# Altium schematic sheet mcu.SchDoc
size A3; SheetNumber: 5; SheetTotal: 11
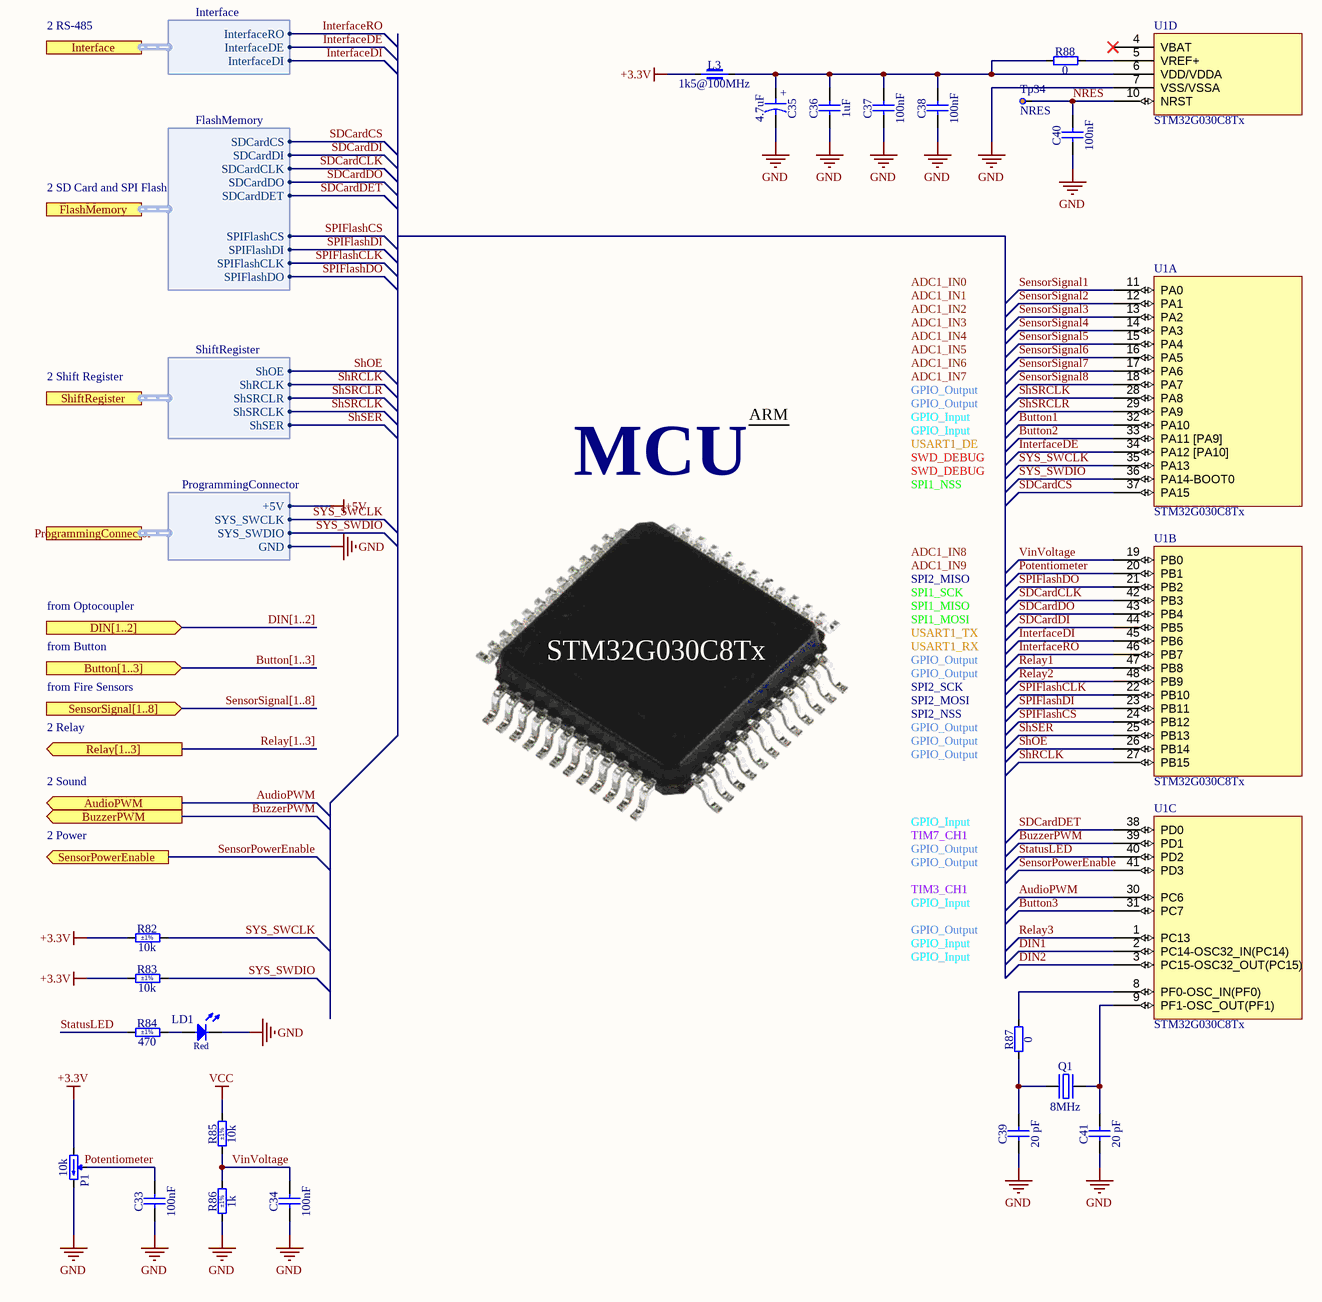
[diagram p0: mcu.SchDoc]

## Parts
C33  100nF  [CAPC1608X87N]
C34  100nF  [CAPC1608X87N]
C35  4.7uF  [CAPMP3216X180N]
C36  1uF  [CAPC1608X87N]
C37  100nF  [CAPC1608X87N]
C38  100nF  [CAPC1608X87N]
C39  20 pF  [CAPC1608X90N]
C40  100nF  [CAPC1608X87N]
C41  20 pF  [CAPC1608X90N]
L3  1k5@100MHz  [INDC2012X110N]
LD1  Red  [LED_AVAGO_HSMH-C150]
P1  10k  [TRIM_BOURNS_3296W]
Q1  8MHz  [XTAL_TXC_7A]
R82  10k  Tolerance: ±1%  [RESC1608X55N]
R83  10k  Tolerance: ±1%  [RESC1608X55N]
R84  470  Tolerance: ±1%  [RESC1608X55N]
R85  10k  Tolerance: ±1%  [RESC1608X55N]
R86  1k  Tolerance: ±1%  [RESC1608X55N]
R87  0  [RESC1608X55N]
R88  0  [RESC1608X55N]
Tp34  NRES  [TP_C40]
U1  STM32G030C8Tx  [ST LQFP-48 7x7MM]  (parts A,B,C,D of 4)

## Ports
AudioPWM (out), Button[1..3] (in), BuzzerPWM (out), DIN[1..2] (in), FlashMemory (harness FlashMemory), Interface (harness Interface), ProgrammingConnector (harness ProgrammingConnector), Relay[1..3] (out), SensorPowerEnable (out), SensorSignal[1..8] (in), ShiftRegister (harness ShiftRegister)

## Harnesses
Interface: InterfaceRO, InterfaceDE, InterfaceDI
FlashMemory: SDCardDO, SDCardCLK, SDCardDI, SDCardCS, SPIFlashCS, SDCardDET, SPIFlashDO, SPIFlashDI, SPIFlashCLK
ShiftRegister: ShOE, ShRCLK, ShSRCLR, ShSRCLK, ShSER
ProgrammingConnector: +5V, SYS_SWCLK, SYS_SWDIO, GND

## Nets
+3.3V: L3.1 P1.1(CCW) R82.1 R83.1
+5V: port ProgrammingConnector.+5V
GND: C33.1 C34.1 C35.2 C36.1 C37.1 C38.1 C39.1 C40.1 C41.1 LD1.1(C) P1.3(CW) R86.1 U1.7(VSS/VSSA) ; port ProgrammingConnector.GND
VCC: R85.2
AudioPWM: U1.30(PC6) ; port AudioPWM
Button1: U1.32(PA10)
Button2: U1.33(PA11_[PA9])
Button3: U1.31(PC7)
BuzzerPWM: U1.39(PD1) ; port BuzzerPWM
DIN1: U1.2(PC14-OSC32_IN(PC14))
DIN2: U1.3(PC15-OSC32_OUT(PC15))
InterfaceDE: U1.34(PA12_[PA10]) ; port Interface.InterfaceDE
InterfaceDI: U1.45(PB6) ; port Interface.InterfaceDI
InterfaceRO: U1.46(PB7) ; port Interface.InterfaceRO
NRES: C40.2 Tp34.1 U1.10(NRST)
Potentiometer: C33.2 P1.2(W) U1.20(PB1)
Relay1: U1.47(PB8)
Relay2: U1.48(PB9)
Relay3: U1.1(PC13)
SDCardCLK: U1.42(PB3) ; port FlashMemory.SDCardCLK
SDCardCS: U1.37(PA15) ; port FlashMemory.SDCardCS
SDCardDET: U1.38(PD0) ; port FlashMemory.SDCardDET
SDCardDI: U1.44(PB5) ; port FlashMemory.SDCardDI
SDCardDO: U1.43(PB4) ; port FlashMemory.SDCardDO
SensorPowerEnable: U1.41(PD3) ; port SensorPowerEnable
SensorSignal1: U1.11(PA0)
SensorSignal2: U1.12(PA1)
SensorSignal3: U1.13(PA2)
SensorSignal4: U1.14(PA3)
SensorSignal5: U1.15(PA4)
SensorSignal6: U1.16(PA5)
SensorSignal7: U1.17(PA6)
SensorSignal8: U1.18(PA7)
ShOE: U1.26(PB14) ; port ShiftRegister.ShOE
ShRCLK: U1.27(PB15) ; port ShiftRegister.ShRCLK
ShSER: U1.25(PB13) ; port ShiftRegister.ShSER
ShSRCLK: U1.28(PA8) ; port ShiftRegister.ShSRCLK
ShSRCLR: U1.29(PA9) ; port ShiftRegister.ShSRCLR
SPIFlashCLK: U1.22(PB10) ; port FlashMemory.SPIFlashCLK
SPIFlashCS: U1.24(PB12) ; port FlashMemory.SPIFlashCS
SPIFlashDI: U1.23(PB11) ; port FlashMemory.SPIFlashDI
SPIFlashDO: U1.21(PB2) ; port FlashMemory.SPIFlashDO
StatusLED: R84.1 U1.40(PD2)
SYS_SWCLK: R82.2 U1.35(PA13) ; port ProgrammingConnector.SYS_SWCLK
SYS_SWDIO: R83.2 U1.36(PA14-BOOT0) ; port ProgrammingConnector.SYS_SWDIO
VinVoltage: C34.2 R85.1 R86.2 U1.19(PB0)
NetC35_1: C35.1 C36.2 C37.2 C38.2 L3.2 R88.1 U1.6(VDD/VDDA)
NetC39_2: C39.2 Q1.1(OSC1) R87.1
NetC41_2: C41.2 Q1.2(OSC2) U1.9(PF1-OSC_OUT(PF1))
NetLD1_2: LD1.2(A) R84.2
NetR87_2: R87.2 U1.8(PF0-OSC_IN(PF0))
NetR88_2: R88.2 U1.5(VREF+)

Not connected (* = marked no-connect by the designer): U1 4(VBAT)*

## Buses and harness runs
bus Button[1..3] = port Button[1..3]
bus DIN[1..2] = port DIN[1..2]
bus Relay[1..3] = port Relay[1..3]
bus SensorSignal[1..8] = port SensorSignal[1..8]

## Notes on the sheet
- 2 RS-485
- 2 SD Card and SPI Flash
- ADC1_IN0
- ADC1_IN1
- ADC1_IN2
- ADC1_IN3
- ADC1_IN4
- 2 Shift Register
- ADC1_IN5
- ADC1_IN6
- ADC1_IN7
- GPIO_Output
- ARM
- USART1_DE
- SWD_DEBUG
- GPIO_Input
- MCU
- SPI1_NSS
- from Optocoupler
- ADC1_IN8
- ADC1_IN9
- SPI2_MISO
- SPI1_MISO
- SPI1_SCK
- from Button
- STM32G030C8Tx
- USART1_RX
- USART1_TX
- SPI1_MOSI
- from Fire Sensors
- 2 Relay
- SPI2_SCK
- SPI2_MOSI
- SPI2_NSS
- 2 Sound
- 2 Power
- TIM7_CH1
- TIM3_CH1
- THIS DOCUMENT AND THE DATA DISCLOSED HEREIN OR
- HEREWITH IS THE PROPERTY OF ALTIUM LIMITED AND MAY
- DWG NO:
- REVISION
- REV:
- DESCRIPTION
- DATE
- APPROVED
- BE FREELY DISTRIBUTED IN WHOLE. NO RIGHTS ARE
- RESERVED OR EXPRESS OR IMPLIED WARANTEE GIVEN.
- ENG:
- APPROVALS
- PROJECT
- DSN:
- CHK:
- REFERENCE DOCUMENTS
- PROJECT REVISION:
- TITLE
- DOCUMENT REVISION:
- DESIGN ITEM:
- BOM:
- FAB DWG:
- PCB DWG:
- ASSY DWG:
- SCALE:
- A3
- SIZE
- CAGE CODE
- FILE NAME
- DWG NO.
- SHEET
- OF
- REV
- (in symbol CTE3216-18_4.7UF_10V_10%_AVX_TPSA475K010T1400) +

## Library data of the parts
C33 C34 C37 C38 C40 = CC0603_100NF_50V_10%_X7R: Non-polarised capacitor; Part Description: SMD Multilayer Chip Ceramic Capacitor; Manufacturer: GENERIC; Manufacturer1 Part Number: 223858615649; Voltage: 50V; TC: X7R; Tolerance: ±10%; Part Number: CC0603_100NF_50V_10%_X7R; Component Kind: Standard; Component Type: Standard; Pin Count: 2; Value: 100nF; Status: Preferred; Manufacturer Part Number: CC0603_100NF_50V_10%_X7R; Case: 0603; Mounted: Yes; Socket: No; SMD: Yes; Sense: No; Manufacturer1 Example: PHYCOMP; Manufacturer1 ComponentHeight: 0.87mm; HelpURL: \\cern.ch\dfs\Applications\Altium\Datasheets\CC0603_X7R_PHYCOMP.pdf; Author: CERN DEM JLC; CreateDate: 03.12.2007; LatestRevisionDate: 03.12.2007
C35 = CTE3216-18_4.7UF_10V_10%_AVX_TPSA475K010T1400: Polarised capacitor; Part Description: Low ESR 1R4 Automotive Solid Tantalum Chip Capacitor; Manufacturer: AVX; Voltage: 10V; Tolerance: ±10%; Part Number: CTE3216-18_4.7UF_10V_10%_AVX_TPSA475K010T1400; Component Kind: Standard; Component Type: Standard; Pin Count: 2; Value: 4.7uF; Status: Preferred; Manufacturer Part Number: TPSA475K010T1400; Case: A; Mounted: Yes; Socket: No; SMD: Yes; Sense: No; ComponentHeight: 1.8mm; HelpURL: \\cern.ch\dfs\Applications\Altium\Datasheets\CTE-LESR_AVX_TPS-AUTO.pdf; Author: CERN DEM JLC; CreateDate: 23.01.2018; LatestRevisionDate: 23.01.2018
C36 = CC0603_1UF_16V_10%_X7R: Non-polarised capacitor; Part Description: SMD Multilayer Chip Ceramic Capacitor; Manufacturer: GENERIC; Manufacturer1 Part Number: 223878615663; Voltage: 16V; TC: X7R; Tolerance: ±10%; Part Number: CC0603_1UF_16V_10%_X7R; Component Kind: Standard; Component Type: Standard; Pin Count: 2; Value: 1uF; Status: None; Manufacturer Part Number: CC0603_1UF_16V_10%_X7R; Case: 0603; Mounted: Yes; Socket: No; SMD: Yes; Sense: No; Manufacturer1 Example: YAGEO PHYCOMP; Manufacturer1 ComponentHeight: 0.9mm; HelpURL: \\cern.ch\dfs\Applications\Altium\Datasheets\CC0603_X7R_PHYCOMP.pdf; Author: CERN DEM JLC; CreateDate: 03.12.2007; LatestRevisionDate: 17.04.2015
C39 C41 = CC0603_20PF_50V_5%_NP0: Non-polarised capacitor; Part Description: SMD Multilayer Chip Ceramic Capacitor; Manufacturer: GENERIC; Manufacturer1 Part Number: CC0603JRNPO9BN200; Voltage: 50V; TC: C0G/NP0; Tolerance: ±5 %; Part Number: CC0603_20PF_50V_5%_NP0; Component Kind: Standard; Component Type: Standard; Pin Count: 2; Value: 20 pF; Status: Preferred; Manufacturer Part Number: CC0603_20PF_50V_5%_NP0; Case: 0603; Mounted: Yes; Socket: No; SMD: Yes; Sense: No; Manufacturer1 Example: YAGEO PHYCOMP; Manufacturer1 ComponentHeight: 0.9 mm; HelpURL: \\cern.ch\dfs\Applications\Altium\Datasheets\CC0603_NPO_YAGEO.pdf; Author: CERN DEM JMW; CreateDate: 27.07.2021; LatestRevisionDate: 27.07.2021
L3 = IND0805_WURTH_742792097: Part Description: SMD EMI Suppression Chip Ferrite Bead (WE-CBF Series); Manufacturer: WURTH ELEKTRONIK; Power: 1A; Resistance: 0.3R; Tolerance: ±25%; Part Number: IND0805_WURTH_742792097; Component Kind: Standard; Component Type: Standard; Pin Count: 2; Value: 1k5@100MHz; Manufacturer Part Number: 742792097; Case: 0805; Mounted: Yes; Socket: No; SMD: Yes; Sense: No; ComponentHeight: 1.1mm; HelpURL: \\cern.ch\dfs\Applications\Altium\Datasheets\IND0805_WURTH_742792097.pdf; Author: CERN DEM MR; CreateDate: 29.06.2017; LatestRevisionDate: 25.10.2018
LD1 = LED_AVAGO_HSMH-C150: LED Red 1C 2A; Part Description: Red Diffused Surface Mount LED (1206 Case); Manufacturer: AVAGO TECHNOLOGIES; PressFit: No; Bonding: No; Part Number: LED_AVAGO_HSMH-C150; Component Kind: Standard; Component Type: Standard; Color: Red; PackageDescription: Red Diffused Chip LED, 2-Leads, Body 3.2 x1.6mm, IPC Medium Density; Manufacturer Part Number: HSMH-C150; Pin Count: 2; Case: 1206; Mounted: Yes; Socket: No; SMD: Yes; Sense: No; ComponentHeight: 1.2mm; HelpURL: \\cern.ch\dfs\Applications\Altium\Datasheets\LED_AVAGO_HSMH-C150.pdf; Author: CERN DEM JLC; CreateDate: 08.03.2018; LatestRevisionDate: 08.03.2018
P1 = TRIM_25T_10K_BOURNS_3296W-1-103LF: Trimming Potentiometer; Part Description: 25 Turn Trimming Potentiometer (Top Adjustment); Manufacturer: BOURNS; Power: 0.5W; TC: ±100ppm/°C; Tolerance: ±10%; PressFit: No; Part Number: TRIM_25T_10K_BOURNS_3296W-1-103LF; Component Kind: Standard; Component Type: Standard; Pin Count: 3; Value: 10k; Manufacturer Part Number: 3296W-1-103LF; Case: 3296W; Mounted: Yes; Socket: No; SMD: No; Sense: No; ComponentHeight: 11.55mm; HelpURL: \\cern.ch\dfs\Applications\Altium\Datasheets\TRIM_BOURNS_3296W.pdf; Author: CERN DEM BC; CreateDate: 02.11.2021; LatestRevisionDate: 02.11.2021
Q1 = XTAL_8MHZ_TXC_7A-8.000MAAE-T: Quartz Crystal; Part Description: Tolerance: ± 30ppm, Stability: ±30ppm, -20°C to +70°C, 12pF, SMD Glass Seam Sealing Crystal, 7A Series; Manufacturer: TXC CORPORATION; PressFit: No; Bonding: No; Part Number: XTAL_8MHZ_TXC_7A-8.000MAAE-T; Component Kind: Standard; Component Type: Standard; PackageDescription: SMD Glass Seam Sealing Crystal, 2 Pins, 3.20mm L X 5.00mm W, 7A Serie; Value: 8MHz; Manufacturer Part Number: 7A-8.000MAAE-T; Pin Count: 2; Mounted: Yes; Socket: No; SMD: Yes; Sense: No; ComponentHeight: 1.2mm; HelpURL: \\cern.ch\dfs\Applications\Altium\Datasheets\XTAL_TXC_7A.pdf; Author: CERN DEM JLC; CreateDate: 09.10.2014; LatestRevisionDate: 12.11.2014
R82 R83 R85 = R0603_10K_1%_0.1W_100PPM: Resistor - 1%; Part Description: General Purpose Thick Film Chip Resistor; Manufacturer: GENERIC; Manufacturer1 Part Number: NRC06F1002TRF; Power: 0.1W; TC: ±100ppm/°C; PressFit: No; Part Number: R0603_10K_1%_0.1W_100PPM; Component Kind: Standard; Component Type: Standard; Pin Count: 2; Value: 10k; Status: Preferred; Manufacturer Part Number: R0603_10K_1%_0.1W_100PPM; Case: 0603; Mounted: Yes; Sense: No; Socket: No; SMD: Yes; Manufacturer1 Example: NIC COMPONENT; Manufacturer1 ComponentHeight: 0.55mm; HelpURL: \\cern.ch\dfs\Applications\Altium\Datasheets\R0603_NIC_NRC.pdf; Author: CERN DEM JLC; CreateDate: 03.12.2007; LatestRevisionDate: 13.03.2008
R84 = R0603_470R_1%_0.1W_100PPM: Resistor - 1%; Part Description: General Purpose Thick Film Chip Resistor; Manufacturer: GENERIC; Manufacturer1 Part Number: NRC06F4700TRF; Power: 0.1W; TC: ±100ppm/°C; PressFit: No; Part Number: R0603_470R_1%_0.1W_100PPM; Component Kind: Standard; Component Type: Standard; Pin Count: 2; Value: 470; Status: Preferred; Manufacturer Part Number: R0603_470R_1%_0.1W_100PPM; Case: 0603; Mounted: Yes; Sense: No; Socket: No; SMD: Yes; Manufacturer1 Example: NIC COMPONENT; Manufacturer1 ComponentHeight: 0.55mm; HelpURL: \\cern.ch\dfs\Applications\Altium\Datasheets\R0603_NIC_NRC.pdf; Author: CERN DEM JLC; CreateDate: 03.12.2007; LatestRevisionDate: 13.03.2008
R86 = R0603_1K_1%_0.1W_100PPM: Resistor - 1%; Part Description: General Purpose Thick Film Chip Resistor; Manufacturer: GENERIC; Manufacturer1 Part Number: NRC06F1001TRF; Power: 0.1W; TC: ±100ppm/°C; PressFit: No; Part Number: R0603_1K_1%_0.1W_100PPM; Component Kind: Standard; Component Type: Standard; Pin Count: 2; Value: 1k; Status: Preferred; Manufacturer Part Number: R0603_1K_1%_0.1W_100PPM; Case: 0603; Mounted: Yes; Sense: No; Socket: No; SMD: Yes; Manufacturer1 Example: NIC COMPONENT; Manufacturer1 ComponentHeight: 0.55mm; HelpURL: \\cern.ch\dfs\Applications\Altium\Datasheets\R0603_NIC_NRC.pdf; Author: CERN DEM JLC; CreateDate: 03.12.2007; LatestRevisionDate: 13.03.2008
R87 R88 = R0603_0R_JUMPER: Resistor; Part Description: 1A (0.05R Max DC Resistance) Zero Ohm Jumper; Manufacturer: GENERIC; Manufacturer1 Part Number: NRC06Z0; PressFit: No; Part Number: R0603_0R_JUMPER; Component Kind: Standard; Component Type: Standard; Pin Count: 2; Value: 0; Status: Preferred; Manufacturer Part Number: R0603_0R_JUMPER; Case: 0603; Mounted: Yes; Sense: No; Socket: No; SMD: Yes; Manufacturer1 Example: NIC COMPONENT; Manufacturer1 ComponentHeight: 0.55mm; HelpURL: \\cern.ch\dfs\Applications\Altium\Datasheets\R0603_NIC_NRC.pdf; Author: CERN DEM JLC; CreateDate: 03.12.2007; LatestRevisionDate: 13.03.2008
Tp34 = Test point: Published: 8-Jun-2000; LatestRevisionDate: 17-Jul-2002; LatestRevisionNote: Re-released for DXP Platform.; PackageReference: AXIAL-0.3; Publisher: Altium Limited
U1 = STM32G030C8Tx: ARM Microcontrollers - MCU Mainstream Value-Line Arm Cortex-M0+ MCU 64 Kbytes of Flash 8 Kbytes RAM, 64 MHz, LQFP48